# EAGLE design mon (EAGLE 6.6.0)
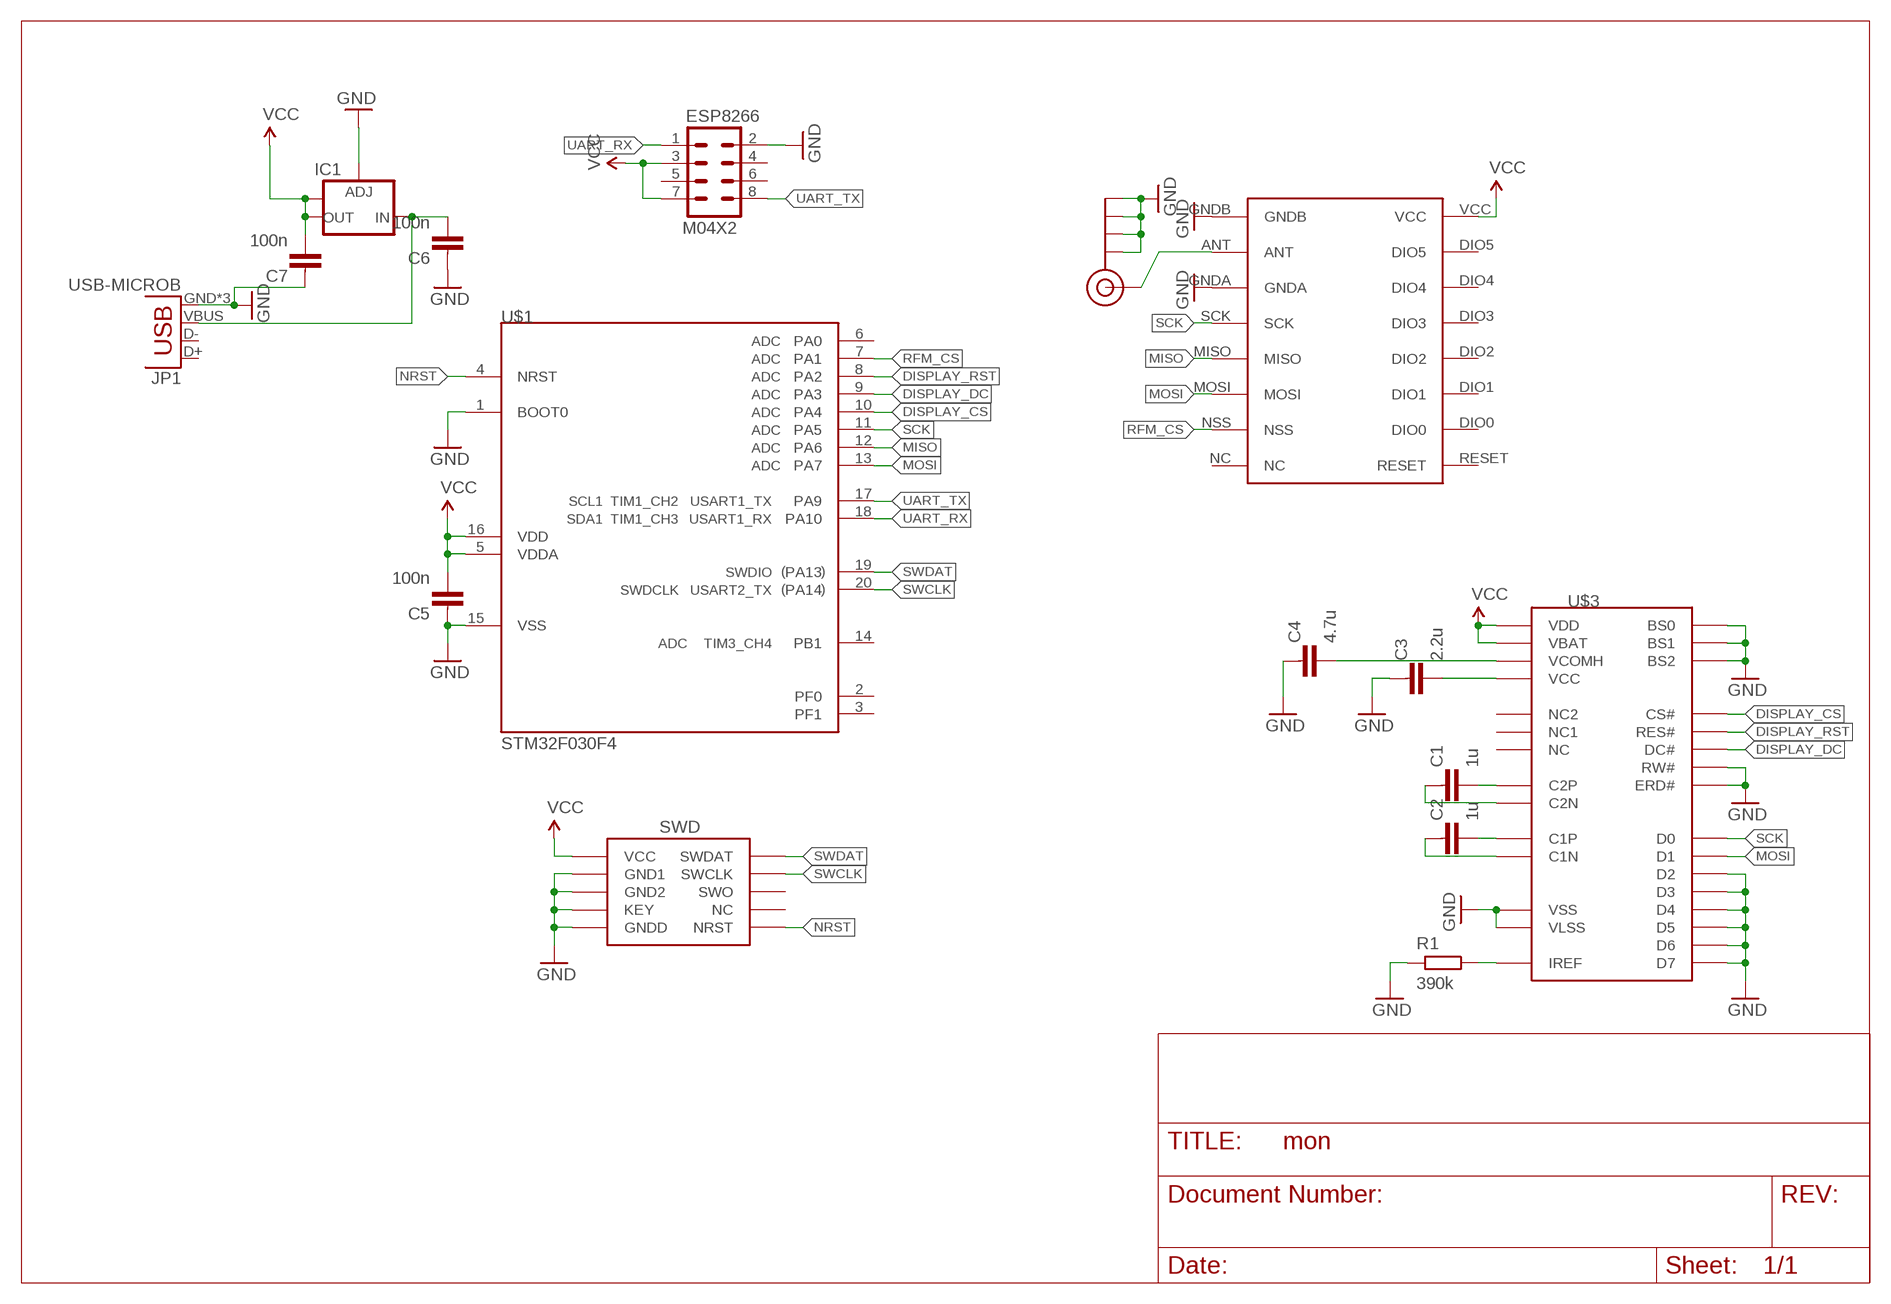
[diagram p0: schematic, sheet 1]

## Parts
C1  1u  CAPACITOR0603-L  [C0603-L]
C2  1u  CAPACITOR0603-L  [C0603-L]
C3  2.2u  CAPACITOR0603-L  [C0603-L]
C4  4.7u  CAPACITOR0603-L  [C0603-L]
C5  100n  CAPACITOR0603-L  [C0603-L]
C6  100n  CAPACITOR0603-L  [C0603-L]
C7  100n  CAPACITOR0603-L  [C0603-L]
ESP8266  M04X2  [2X4]
IC1  V_REG_LM1117SOT223  [SOT223]
J$1  SMA_EDGE  [SMA-EDGE]
JP1  USB-MICROB  [USB-MICROB]
R1  390k  RESISTOR0603-L  [R0603-L]
U$1  STM32F030F4  [TSSOP20]
U$2  RFM69HW  [RFM]
U$3  096_INCH_MONOCHROME_DISP  [096_INCH_MONOCHROME_DISP]
U$4  SWD_SHROUD_SMD  [SWD_SMD_SHROUD]

## Nets
DISPLAY_CS: U$1.10(PA4) U$3.P$13(CS#)
DISPLAY_DC: U$1.9(PA3) U$3.P$15(DC#)
DISPLAY_RST: U$1.8(PA2) U$3.P$14(RES#)
GND: C3.1 C4.1 C5.1 C6.1 C7.1 ESP8266.2 IC1.1(ADJ) J$1.GND@0(GND) J$1.GND@1(GND) J$1.GND@2(GND) J$1.GND@3(GND) JP1.GND JP1.MT1(GND) JP1.MT2(GND) R1.1 U$1.1(BOOT0) U$1.15(VSS) U$2.GNDA U$2.GNDB U$3.P$8(VSS) U$3.P$10(BS0) U$3.P$11(BS1) U$3.P$12(BS2) U$3.P$16(RW#) U$3.P$17(ERD#) U$3.P$20(D2) U$3.P$21(D3) U$3.P$22(D4) U$3.P$23(D5) U$3.P$24(D6) U$3.P$25(D7) U$3.P$29(VLSS) U$4.3(GND1) U$4.5(GND2) U$4.7(KEY) U$4.9(GNDD)
MISO: U$1.12(PA6) U$2.MISO
MOSI: U$1.13(PA7) U$2.MOSI U$3.P$19(D1)
N$1: J$1.SIG(SIGNAL) U$2.ANT
N$2: C6.2 IC1.3(IN) JP1.VBUS
N$3: C1.2 U$3.P$2(C2P)
N$4: C1.1 U$3.P$3(C2N)
N$5: C2.2 U$3.P$4(C1P)
N$6: C2.1 U$3.P$5(C1N)
N$7: R1.2 U$3.P$26(IREF)
N$8: C3.2 U$3.P$28(VCC)
N$9: C4.2 U$3.P$27(VCOMH)
NRST: U$1.4(NRST) U$4.10(NRST)
RFM_CS: U$1.7(PA1) U$2.NSS
SCK: U$1.11(PA5) U$2.SCK U$3.P$18(D0)
SWCLK: U$1.20(PA14) U$4.4(SWCLK)
SWDAT: U$1.19(PA13) U$4.2(SWDAT)
UART_RX: ESP8266.1 U$1.18(PA10)
UART_TX: ESP8266.8 U$1.17(PA9)
VCC: C5.2 C7.2 ESP8266.3 ESP8266.7 IC1.2(OUT) IC1.4(OUT) U$1.5(VDDA) U$1.16(VDD) U$2.VCC U$3.P$6(VBAT) U$3.P$9(VDD) U$4.1(VCC)
Unconnected: ESP8266.4 ESP8266.5 ESP8266.6 JP1.D+ JP1.D- U$1.2(PF0) U$1.3(PF1) U$1.6(PA0) U$1.14(PB1) U$2.DIO0 U$2.DIO1 U$2.DIO2 U$2.DIO3 U$2.DIO4 U$2.DIO5 U$2.NC U$2.RESET U$3.P$1(NC) U$3.P$7(NC1) U$3.P$30(NC2) U$4.6(SWO) U$4.8(NC)

## Library data of the parts
C1-C7 = passives-7351:CAPACITOR
ESP8266 = SparkFun-Connectors:M04X2: .1" header, two rows of four.
IC1 = SparkFun-PowerIC:V_REG_LM1117: Voltage Regulator LM1117 Standard adjustable voltage regulator but in SMD form. Spark Fun Electronics SKU : COM-00595; PROD_ID: VREG-08170
J$1 = jonsowman:SMA_EDGE: SMA Antenna Connector End launch SMA connector. The paste layer has been removed so that the connector can be hand soldered onto the board after reflow.
JP1 = SparkFun-Connectors:USB: USB Connectors USB-B-PTH is fully proven SKU : PRT-00139/CONN-08278 USB-miniB is fully proven SKU : PRT-00587 USB-A-PCB is untested. USB-A-H is throughly reviewed, but untested. Spark Fun Electronics SKU : PRT-00437 USB-B-SMT is throughly reviewed, but untested. Needs silkscreen touching up. USB-A-S has not been used/tested USB-MB-H has not been used/tested USB-MICROB has been used. CONN-09505; PROD_ID: CONN-09505
R1 = passives-7351:RESISTOR
U$1 = dtb:STM32F030F4
U$2 = hoperf:RFM69HW
U$3 = jonsowman:096_INCH_MONOCHROME_DISP
U$4 = dtb:SWD_SHROUD

## Board
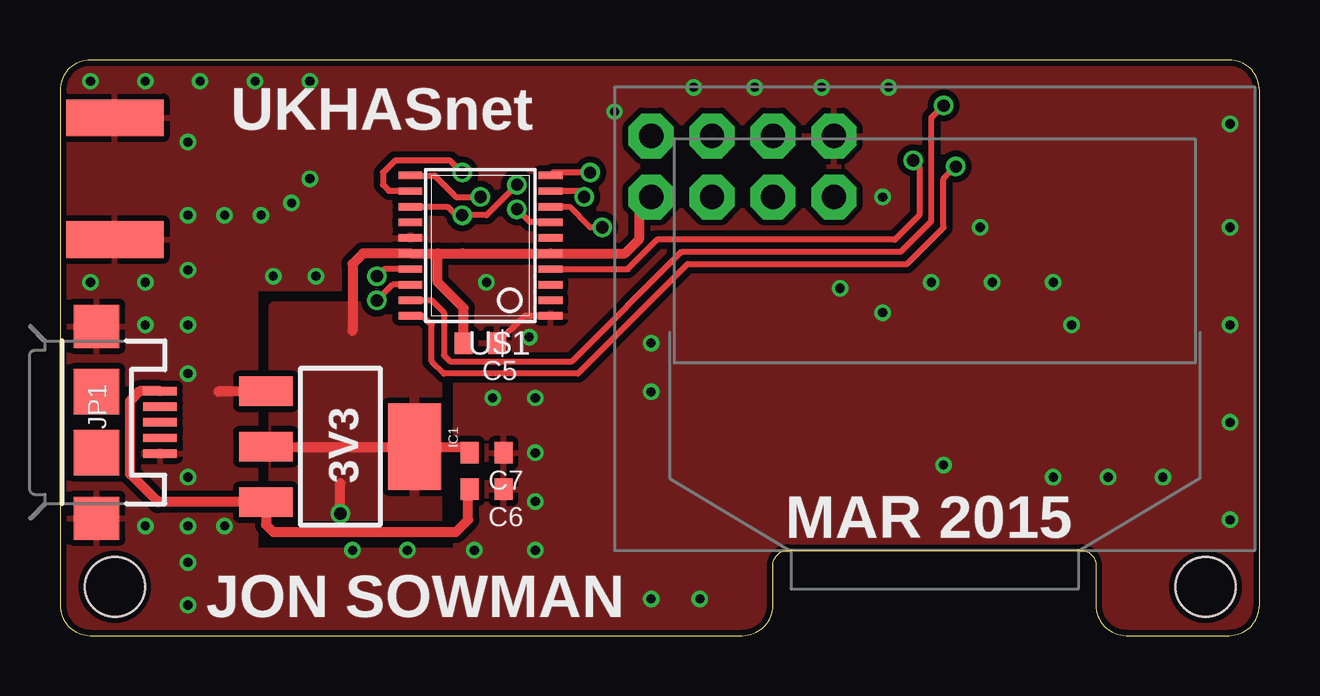
[diagram p1: board, top side]
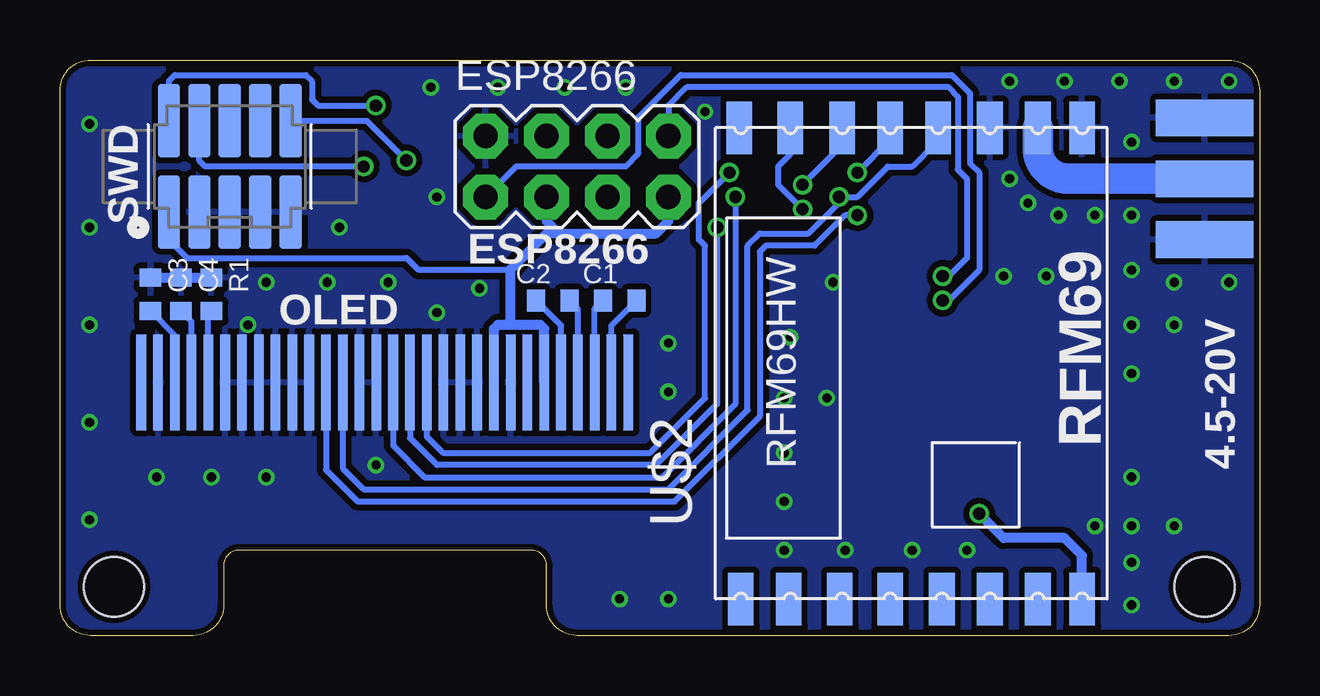
[diagram p2: board, bottom side, seen from below]

Size 50 x 24 mm. Coordinates in mm from the lower left corner, seen from the top.
Outline: 0,22.73 0,1.27 arc90 1.27,0 28.45,0 arc90 29.72,1.27 29.72,2.92 arc-90 30.35,3.56 42.55,3.56 arc-90 43.18,2.92 43.18,1.27 arc90 44.45,0 48.73,0 arc90 50,1.27 50,22.73 arc90 48.73,24 1.27,24 arc90 0,22.73
Copper layers (1*16): Top 0.035mm / dielectric 1.5mm / Bottom 0.035mm
Design rules "SeeedStudio_2layer_DRU_no_angle_20140221 *": minimum track width 6mil, minimum drill 12mil, track to track 6mil, track to pad 6mil, pad to pad 6mil, via to via 6mil, smd to smd 0mil, copper to edge 10mil, drill to drill 10mil, minimum pad ring 10mil, minimum via ring 6mil, stop-mask expansion 2mil, vias tented up to drill 100mil, thermal gap 10mil
Holes 2.5 mm at 2.29,2.03 47.75,2.03

### Footprints (pad centres in the part's own frame; a part is rotated, then mirrored left to right if it is on the bottom)
C0603-L = smd 0.75 x 0.9: 1 -0.7,0; 2 0.7,0
2X4 = drill 1.016 pad 1.88 octagon: 1 -3.81,-1.27; 2 -3.81,1.27; 3 -1.27,-1.27; 4 -1.27,1.27; 5 1.27,-1.27; 6 1.27,1.27; 7 3.81,-1.27; 8 3.81,1.27
SOT223 = smd 1.219 x 2.235: 1 -2.311,-3.099; 2 0,-3.099; 3 2.311,-3.099 | smd 3.6 x 2.2: 4 0,3.099
SMA-EDGE = smd 1.524 x 4.064: GND@0 0,0; GND@1 5.08,0; SIG 2.54,0 | smd 1.524 x 4.064 bottom: GND@2 0,0; GND@3 5.08,0
USB-MICROB = smd 0.35 x 1.4: D+ 0,2.65; D- -0.65,2.65; GND 1.3,2.65; ID 0.65,2.65; VBUS -1.3,2.65 | smd 1.8 x 1.9: MT1 -4,0; MT2 4,0 | smd 1.9 x 1.9: P$1 -1.27,0; P$2 1.27,0
R0603-L = smd 0.75 x 0.9: 1 -0.7,0; 2 0.7,0
TSSOP20 = smd 0.305 x 0.991: 1 -2.925,-2.918; 2 -2.275,-2.918; 3 -1.625,-2.918; 4 -0.975,-2.918; 5 -0.325,-2.918; 6 0.325,-2.918; 7 0.975,-2.918; 8 1.625,-2.918; 9 2.275,-2.918; 10 2.925,-2.918; 11 2.925,2.918; 12 2.275,2.918; 13 1.625,2.918; 14 0.975,2.918; 15 0.325,2.918; 16 -0.325,2.918; 17 -0.975,2.918; 18 -1.625,2.918; 19 -2.275,2.918; 20 -2.925,2.918
RFM = smd 2.184 x 1.067: ANT 19.651,2.889; DIO0 0,13.27; DIO1 0,11.143; DIO2 0,9.047; DIO3 0,6.889; DIO4 0,4.889; DIO5 0,2.889; GNDA 19.651,4.889; GNDB 19.651,1.048; MISO 19.651,9.047; MOSI 19.651,11.047; NC 19.651,15.334; NSS 19.651,13.206; RESET 0,15.27; SCK 19.651,7.048; VCC 0,1.048
096_INCH_MONOCHROME_DISP = smd 0.4 x 4 bottom: P$1 3.2,7; P$2 3.9,7; P$3 4.6,7; P$4 5.3,7; P$5 6,7; P$6 6.7,7; P$7 7.4,7; P$8 8.1,7; P$9 8.8,7; P$10 9.5,7; P$11 10.2,7; P$12 10.9,7; P$13 11.6,7; P$14 12.3,7; P$15 13,7; P$16 13.7,7; P$17 14.4,7; P$18 15.1,7; P$19 15.8,7; P$20 16.5,7; P$21 17.2,7; P$22 17.9,7; P$23 18.6,7; P$24 19.3,7; P$25 20,7; P$26 20.7,7; P$27 21.4,7; P$28 22.1,7; P$29 22.8,7; P$30 23.5,7
SWD_SMD_SHROUD = smd 0.914 x 3.048: 1 -2.54,-1.905; 2 -2.54,1.905; 3 -1.27,-1.905; 4 -1.27,1.905; 5 0,-1.905; 6 0,1.905; 7 1.27,-1.905; 8 1.27,1.905; 9 2.54,-1.905; 10 2.54,1.905

### Placement (x,y rotation side)
C1  26.67,13.97 0 bottom
C2  29.46,13.97 0 bottom
C3  46.23,14.22 270 bottom
C4  44.96,14.22 270 bottom
C5  17.53,12.19 180 top
C6  17.78,6.1 180 top
C7  17.78,7.62 180 top
ESP8266  28.45,19.56 0 bottom
IC1  11.68,7.87 270 top
J$1  2.29,21.59 270 bottom
JP1  1.52,8.89 270 top
R1  43.69,14.22 270 bottom
U$1  17.53,16.26 90 top
U$2  6.35,1.52 90 bottom
U$3  23.11,3.56 0 top
U$4  42.93,19.56 0 bottom

### Tracks (layer width: path | path; a pad name or v marks a point on that pad's centre or on a via)
DISPLAY_CS  (via drill 0.51)
  Top 0.254: v22.1,19.3 20.57,19.3 U$1.10
  Bottom 0.254: U$3.P$13 34.71,8.3 34.04,7.62 25.4,7.62 23.11,9.91 23.11,16.26 23.37,16.51 23.37,18.03 v22.1,19.3
DISPLAY_DC  (via drill 0.51)
  Top 0.254: U$1.9 20.45,18.54 21.59,18.54 v21.84,18.29
  Bottom 0.254: U$3.P$15 36.11,7.92 34.8,6.6 24.89,6.6 21.84,9.65 v21.84,18.29
DISPLAY_RST  (via drill 0.51)
  Top 0.254: U$1.8 21.23,17.88 22.1,17.02 v22.61,17.02
  Bottom 0.254: v22.61,17.02 22.61,9.65 25.15,7.11 34.29,7.11 35.41,8.24 U$3.P$14
GND  (via drill 0.38)
  Top 0.254: U$1.1 19.36,13.33 C5.1
  Top 0.406: IC1.1 6.63,10.19 6.6,10.16
  Bottom 0.406: C3.1 C4.1 R1.1
  other vias: 1.27,23.11 3.56,23.11 5.84,23.11 5.33,17.53 3.56,12.95 5.33,12.95 5.33,4.57 3.56,4.57 5.33,3.05 5.33,1.27 19.56,12.45 18.03,9.91 19.81,9.91 19.81,7.62 19.81,5.59 19.81,3.56 8.89,14.99 10.67,14.99 10.41,23.11 24.64,12.19 24.64,10.16 24.64,1.52 26.67,1.52 36.32,14.73 38.86,14.73 41.4,14.73 38.35,17.02 48.77,17.02 48.77,12.95 48.77,8.89 48.77,4.83 48.77,21.34 26.42,22.86 28.96,22.86 31.75,22.86 34.54,22.86 34.29,18.29 32.51,14.48 41.4,6.6 43.69,6.6 45.97,6.6 6.86,17.53 8.38,17.53 17.78,14.73 9.65,18.03 10.41,19.05 8.13,23.11 5.33,20.57 34.29,13.46 42.16,12.95 23.11,21.84 6.86,4.57 12.19,3.56 14.48,3.56 17.27,3.56 5.33,15.24 36.83,7.11 5.33,10.92 5.33,6.6 1.27,14.73 3.56,14.73
  pour Bottom (isolate 0.254): 0,23.88 0,0 50.04,0 50.04,23.88
  pour Top (isolate 0.254): 0,0 0,24.13 50.04,24.13 50.04,0 8.38,0 8.38,3.56 16.51,3.56 16.51,14.48 8.13,14.48 8.13,0
MISO  (via drill 0.51)
  Top 0.254: v16.76,19.3 16.26,19.81 13.97,19.81 13.46,19.3 13.46,18.8 13.72,18.54 14.6,18.54 U$1.12
  Bottom 0.254: U$2.MISO 15.4,20.67 v16.76,19.3
MOSI  (via drill 0.51, 0.51 pad 0.3)
  Top 0.254: U$1.13 16.16,17.88 16.51,17.53 v16.76,17.53 17.78,17.53 v19.05,18.8
  Bottom 0.254: U$3.P$19 38.91,6.91 37.59,5.59 24.38,5.59 20.83,9.14 20.83,16 20.57,16.26 18.54,16.26 17.27,17.53 v16.76,17.53 | U$2.MOSI 17.4,20.45 v19.05,18.8
N$1
  Bottom 1.27: U$2.ANT 9.24,20.32 arc-90 7.97,19.05 J$1.SIG
N$2
  Top 0.406: C6.2 17.02,6.03 17.02,4.83 16.51,4.32 8.89,4.32 8.59,4.62 IC1.3 4.09,5.56 2.92,6.73 2.92,9.78 3.33,10.19 JP1.VBUS
N$3
  Bottom 0.254: U$3.P$2 27.01,12.93 C1.2
N$4
  Bottom 0.254: U$3.P$3 27.71,13.63 C1.1
N$5
  Bottom 0.254: U$3.P$4 28.41,13.62 C2.2
N$6
  Bottom 0.254: U$3.P$5 29.11,12.92 C2.1
N$7
  Bottom 0.254: U$3.P$26 43.81,13.4 R1.2
N$8
  Bottom 0.254: 46.54,13.52 C3.2 45.21,12.51 U$3.P$28
N$9
  Bottom 0.254: U$3.P$27 44.51,13.08 C4.2
NRST  (via drill 0.51)
  Top 0.254: v35.56,19.81 35.81,19.56 35.81,17.53 34.8,16.51 24.89,16.51 23.66,15.28 U$1.4
  Bottom 0.254: U$4.10 37.21,21.46 v35.56,19.81
RFM_CS  (via drill 0.51)
  Top 0.254: U$1.7 19.6,17.23 v19.05,17.78
  Bottom 0.254: U$2.NSS 19.56,20.07 20.07,19.56 20.07,18.8 v19.05,17.78
SCK  (via drill 0.51)
  Top 0.254: U$1.11 15.62,19.18 16.51,18.29 v17.53,18.29
  Bottom 0.254: U$3.P$18 38.21,6.97 37.34,6.1 24.64,6.1 21.34,9.4 21.34,16.26 20.83,16.76 18.8,16.76 17.53,18.03 v17.53,18.29 16.76,18.29 15.49,19.56 14.48,19.56 13.46,20.57 13.46,21.11 U$2.SCK
SWCLK  (via drill 0.51)
  Top 0.254: U$1.20 15.12,13.33 15.49,12.95 15.49,11.43 16,10.92 21.59,10.92 26.16,15.49 35.31,15.49 36.83,17.02 36.83,19.05 v37.34,19.56
  Bottom 0.254: v37.34,19.56 43.94,19.56 44.2,19.81 U$4.4
SWDAT  (via drill 0.51)
  Top 0.254: v36.83,22.1 36.32,21.59 36.32,17.27 35.05,16 25.91,16 21.34,11.43 16.26,11.43 16,11.68 16,13.46 15.48,13.98 U$1.19
  Bottom 0.254: U$4.2 45.47,23.11 45.21,23.37 39.75,23.37 39.5,23.11 39.5,22.35 39.24,22.1 v36.83,22.1
UART_RX  (via drill 0.51)
  Top 0.254: U$1.18 13.87,14.63 v13.21,13.97
  Bottom 0.254: v13.21,13.97 12.95,13.97 11.68,15.24 11.68,19.3 12.06,19.68 12.06,22.61 12.83,23.37 24.13,23.37 25.91,21.59 25.91,20.07 26.42,19.56 30.99,19.56 ESP8266.1
UART_TX  (via drill 0.51)
  Top 0.254: U$1.17 13.5,15.28 v13.21,14.99
  Bottom 0.254: v13.21,14.99 12.95,14.99 12.19,15.75 12.19,19.05 12.57,19.43 12.57,22.48 12.95,22.86 23.88,22.86 24.64,22.1 ESP8266.8
VCC  (via drill 0.51 pad 0.81)
  Top 0.254: 16.83,15.87 16.76,15.93
  Top 0.406: IC1.2 IC1.4 16.83,7.87 C7.2 | 15.75,15.93 U$1.16 12.63,15.93 12.19,15.49 12.19,12.7 | 15.75,15.93 16.76,15.93 U$1.5 23.55,15.93 24.13,16.51 24.13,17.78 ESP8266.7 | v11.68,5.08 11.68,6.35 | C5.2 16.83,13.65 15.75,14.73 15.75,15.93
  Bottom 0.254: U$4.1 45.47,16.51 44.7,15.75 35.56,15.75 35.05,15.24 31.24,15.24
  Bottom 0.406: U$3.P$6 29.81,12.8 29.97,12.95 31.24,12.95 | ESP8266.3 29.72,17.27 29.21,16.76 | 29.21,16.76 25.15,16.76 24.64,17.27 ESP8266.7 | 29.21,16.76 29.72,16.76 31.24,15.24 31.24,12.95 | U$2.VCC 7.4,3.33 8.13,4.06 10.67,4.06 v11.68,5.08 | 31.24,12.95 31.75,12.95 31.91,12.79 U$3.P$9
  pour Top (isolate 0.254): 8.89,13.72 8.89,4.32 15.75,4.32 15.75,13.72

### Text on the board
tPlace: UKHASnet | 3V3 | MAR 2015 | JON SOWMAN
bPlace: SWD | ESP8266 | 4.5-20V | OLED | RFM69